# Altium schematic sheet Motor_Driver_2018Sch.SchDoc
size A4
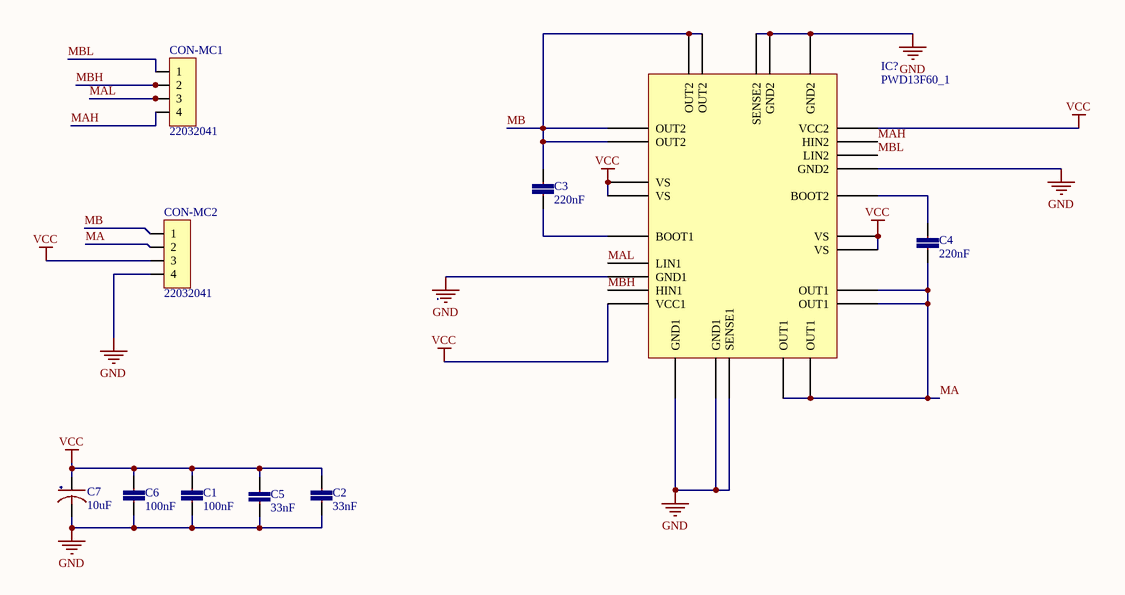
[diagram p0: Motor_Driver_2018Sch.SchDoc]

## Parts
C1  100nF  [0402-CAP]
C2  33nF  [0402-CAP]
C3  220nF  [0402-CAP]
C4  220nF  [0402-CAP]
C5  33nF  [0402-CAP]
C6  100nF  [0402-CAP]
C7  10uF  [1206_CAP_TANT]
CON-MC1  22032041  [04x01_Conector_Male]
CON-MC2  22032041  [04x01_Conector_Male]
IC?  PWD13F60_1  [QFN50P1000X1300X85_HS-61N]

## Nets
GND: C1.2 C2.2 C5.2 C6.2 C7.2(-) CON-MC2.4 IC?.7(GND1) IC?.10(GND1) IC?.11(GND1) IC?.12(SENSE1) IC?.20(GND2) IC?.24(GND2) IC?.25(GND2) IC?.26(SENSE2)
VCC: C1.1 C2.1 C5.1 C6.1 C7.1(+) CON-MC2.3 IC?.3(VS) IC?.4(VS) IC?.9(VCC1) IC?.17(VS) IC?.18(VS) IC?.23(VCC2)
MA: C4.2 CON-MC2.2 IC?.13(OUT1) IC?.14(OUT1) IC?.15(OUT1) IC?.16(OUT1)
MAH: CON-MC1.4 IC?.22(HIN2)
MAL: CON-MC1.3 IC?.6(LIN1)
MB: C3.1 CON-MC2.1 IC?.1(OUT2) IC?.2(OUT2) IC?.27(OUT2) IC?.28(OUT2)
MBH: CON-MC1.2 IC?.8(HIN1)
MBL: CON-MC1.1 IC?.21(LIN2)
NetC3_2: C3.2 IC?.5(BOOT1)
NetC4_1: C4.1 IC?.19(BOOT2)

## Library data of the parts
C1 C6 = CC0402-100nF-50v-A.3: CAP CER 0.1UF 50V 10% X7R 0402; Part No: C1005X7R1H104K050BB; Cod EMS: 05.281.019.021; Value: 100n
C2 C5 = CC0402-33nF-5: CAP CER 0.033UF 25V 10% X7R 0402; Part No: GRM155R71E333KA88J; Cod EMS: 05.281.019.505; Value: 33n
C3 C4 = CC0402-220nF-5: CAP CER 0.22UF 16V 10% X7R 0402; Part No: GRM155R71C224KA12D; Cod EMS: 05.281.019.502; Value: 220n
C7 = CT3216-10uF-1: CAP TANT 10uF 10% 16V CASE A ESR = 3 Ohm @ 100 kHz; Part No: TAJA106K016RNJ; Manufacturer: AVX Corporation; Cod EMS: 05.281.019.213
CON-MC1 CON-MC2 = 04x01_Conector_Male-SCH: CONN HEADER 4POS .100 VERT TIN
IC? = PWD13F60_1-01.A.8: High Voltage Full Bridge